# EAGLE schematic HOR_water_tight_microUSB_raiser (EAGLE 9.7.0)
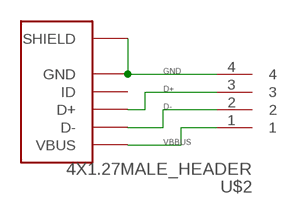
[diagram p0: schematic, sheet 1]

## Parts
U$1  VERTICAL_MICRO_USBCUI_HOR_T4  [CUI_UJ2-MIBH-4-SMT-TR-67]
U$2  4X1.27MALE_HEADER  [4X1.27MALE_HHEADER]

## Nets
D+: U$1.3(D+) U$2.3
D-: U$1.2(D-) U$2.2
GND: U$1.5(GND) U$1.S1(SHIELD) U$1.S2(SHIELD) U$2.4
VBBUS: U$1.1(VBUS) U$2.1
Unconnected: U$1.4(ID)

## Library data of the parts
U$1 = MY_CLOCK_LIB_COMPONENTS:VERTICAL_MICRO_USB
U$2 = MY_CLOCK_LIB_COMPONENTS:4X1.27MALE_HEADER